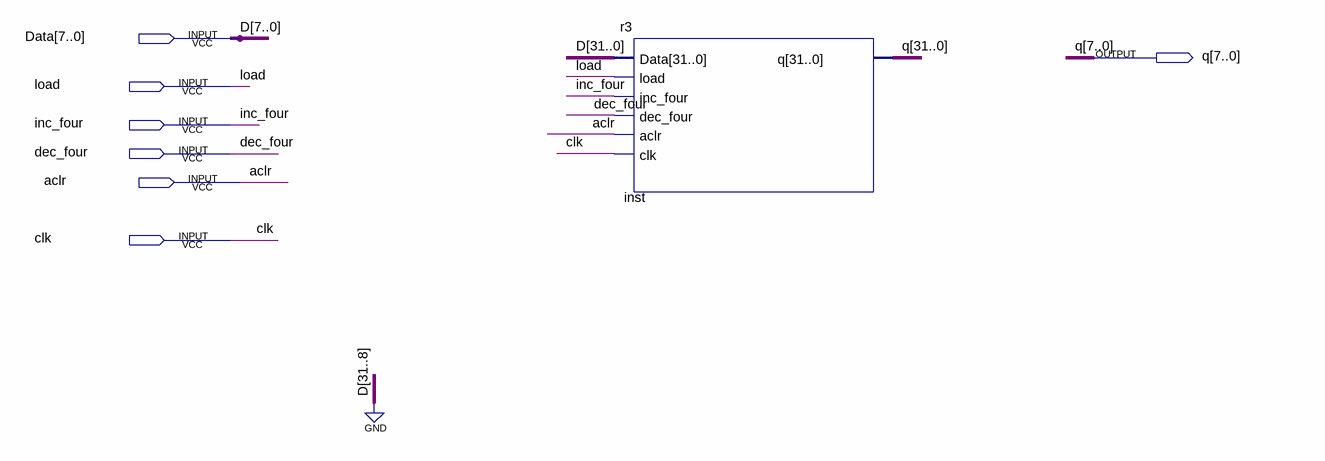
[diagram p0: schematic sheet]
// Quartus schematic r3_8bit.bdf as structural Verilog: 1 symbols, 7 pins
module r3_8bit (
  input  [7:0] Data,
  input  load,
  input  inc_four,
  input  dec_four,
  input  aclr,
  input  clk,
  output [31:0] q
);

  r3 inst (
    .Data({{24{1'b0}}, Data}), .load(load), .inc_four(inc_four), .dec_four(dec_four), .aclr(aclr), .clk(clk),
    .q(q));

  // Other names for the same wires on the sheet: D[7:0] = Data
endmodule
